# EAGLE design board_012518 (EAGLE 8.6.0)
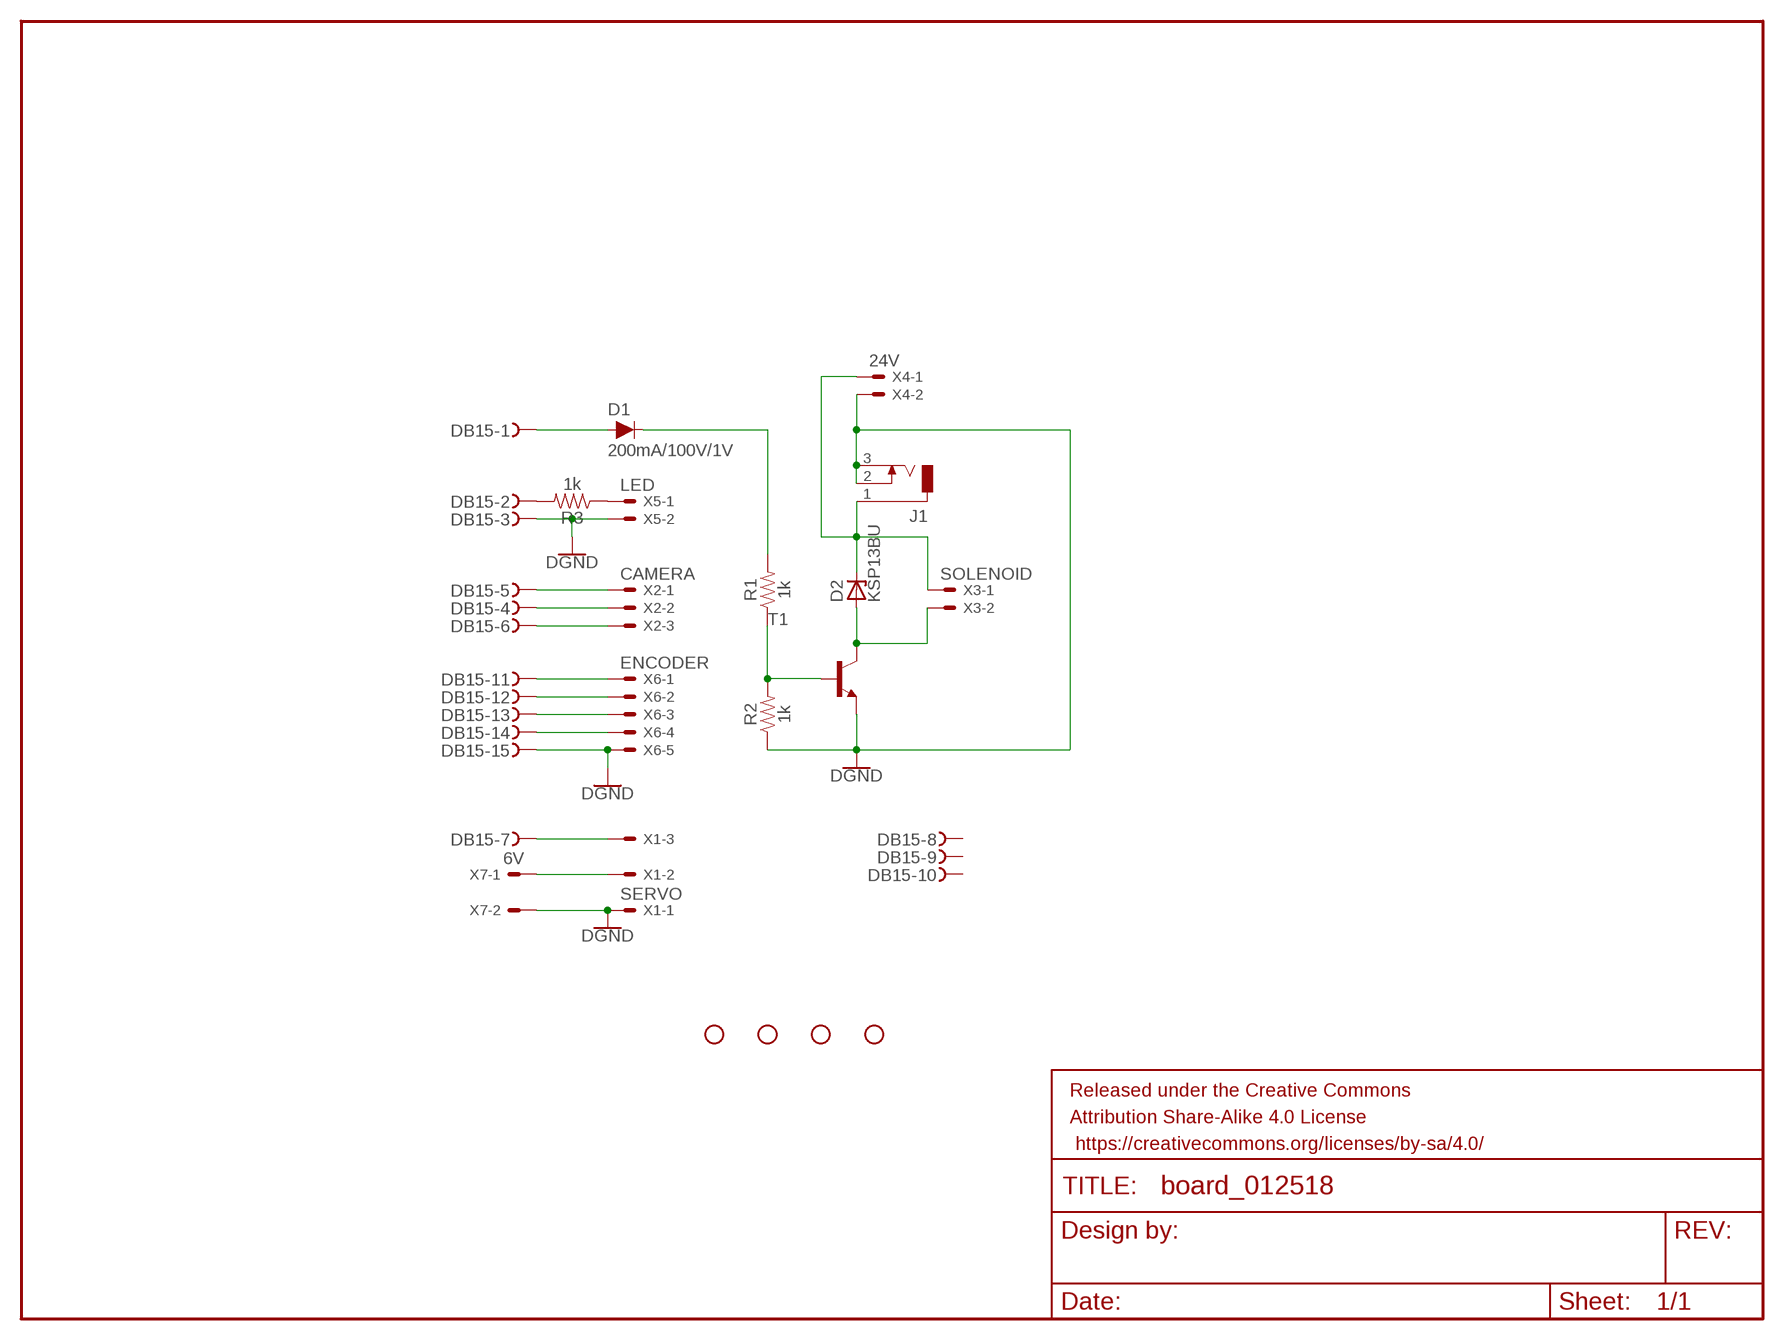
[diagram p0: schematic, sheet 1]

## Parts
D1  200mA/100V/1V  DIODE-1N4148  [DIODE-1N4148]
D2  KSP13BU  ZENER-DIODEP1-12  [P1Z12]
DB15  D-SUB15-HDR15RA  [HDR15RA]
FRAME1  FRAME-LETTER  [CREATIVE_COMMONS]
H1  STAND-OFF  [STAND-OFF]
H2  STAND-OFF  [STAND-OFF]
H3  STAND-OFF  [STAND-OFF]
H4  STAND-OFF  [STAND-OFF]
J1  DCJ0303  [DCJ0303]
R1  1k  1KOHM-HORIZ-1/4W-1%  [AXIAL-0.3]
R2  1k  1KOHM-HORIZ-1/4W-1%  [AXIAL-0.3]
R3  1k  1KOHM-HORIZ-1/4W-1%  [AXIAL-0.3]
T1  MPSA13-NPN-TO92-EBC  [TO92-EBC]
X1  SERVO  C-GRID-03-70553  [70553-03]
X2  CAMERA  C-GRID-03-70553  [70553-03]
X3  SOLENOID  C-GRID-02-70553  [70553-02]
X4  24V  C-GRID-02-70553  [70553-02]
X5  LED  C-GRID-02-70553  [70553-02]
X6  ENCODER  C-GRID-05-70553  [70553-05]
X7  6V  C-GRID-02-70553  [70553-02]

## Nets
GND: DB15.3 DB15.15 J1.2 J1.3 R2.P$1 T1.E X1.1 X4.2 X5.2 X6.5 X7.2 ; supply symbol labelled DGND
N$1: R1.P$1 R2.P$2 T1.B
N$2: D1.C R1.P$2
N$3: D1.A DB15.1
N$4: D2.A T1.C X3.2
N$5: D2.C J1.1 X3.1 X4.1
N$6: X1.2 X7.1
N$7: R3.P$1 X5.1
N$8: DB15.11 X6.1
N$9: DB15.12 X6.2
N$10: DB15.4 X2.2
N$11: DB15.13 X6.3
N$12: DB15.2 R3.P$2
N$13: DB15.14 X6.4
N$14: DB15.5 X2.1
N$16: DB15.6 X2.3
N$17: DB15.7 X1.3
Unconnected: DB15.8 DB15.9 DB15.10

## Library data of the parts
D1 = SparkFun-DiscreteSemi:DIODE: Diode These are standard reverse protection diodes and small signal diodes. SparkFun Products: SparkFun SparkPunk Sound Kit <https://www.sparkfun.com/products/11177> SparkFun ESP8266 Thing <https://www.sparkfun.com/products/13231>; PROD_ID: DIO-08378
D2 = diode:ZENER-DIODE: Z-Diode
DB15 = con-thomas-betts:D-SUB15-: D-Subminiatur Connector Source: Electronioc Interconnects European Edition 1998; OC_FARNELL: unknown; OC_NEWARK: unknown
FRAME1 = SparkFun-Aesthetics:FRAME-LETTER: Schematic Frame - Letter Standard 8.5x11 US Letter frame
H1-H4 = SparkFun-Hardware:STAND-OFF: Stand Off Drill holes for mechanically mounting via screws, standoffs, etc. Note: Use the keepout ring to avoid running the screw head into surrounding components. Variant Overviews STAND-OFF - Mechanical footprint for a #4 phillips button head screw. STAND-OFF-TIGHT - Mechanical footprint for a #4 phillips button head screw, Example SparkFun Products Screw - Phillips Head (1/4", 4-40, 10 pack) <https://www.sparkfun.com/products/10453> (PRT-10453) Screw - Phillips Head (1/2", 4-40, 10 pack) <https://www.sparkfun.com/products/10452> (PRT-10452) Screw - Phillips Head (3/4", 4-40, 10 pack) <https://www.sparkfun.com/products/10451> (PRT-10451) Screw - Phillips Head (1", 4-40, 10 pack) <https://www.sparkfun.com/products/10450> (PRT-10450)
J1 = con-jack:DCJ0303: DC POWER JACK Source: DCJ0303.pdf; OC_FARNELL: unknown; OC_NEWARK: unknown
R1-R3 = SparkFun-Resistors:1KOHM: 1kΩ resistor A resistor is a passive two-terminal electrical component that implements electrical resistance as a circuit element. Resistors act to reduce current flow, and, at the same time, act to lower voltage levels within circuits. - Wikipedia; PROD_ID: RES-12182
T1 = transistor:*-NPN-: NPN Transistror BF959 corrected 2008.03.06
X1 X2 = con-molex:C-GRID-03: CONNECTOR wire to board 2.54 mm (0.100") pitch header; MF: MOLEX; OC_FARNELL: unknown; OC_NEWARK: unknown
X3-X5 X7 = con-molex:C-GRID-02: CONNECTOR wire to board 2.54 mm (0.100") pitch header; MF: MOLEX; OC_FARNELL: unknown; OC_NEWARK: unknown
X6 = con-molex:C-GRID-05: CONNECTOR wire to board 2.54 mm (0.100") pitch header; MF: MOLEX; OC_FARNELL: unknown; OC_NEWARK: unknown

## Board
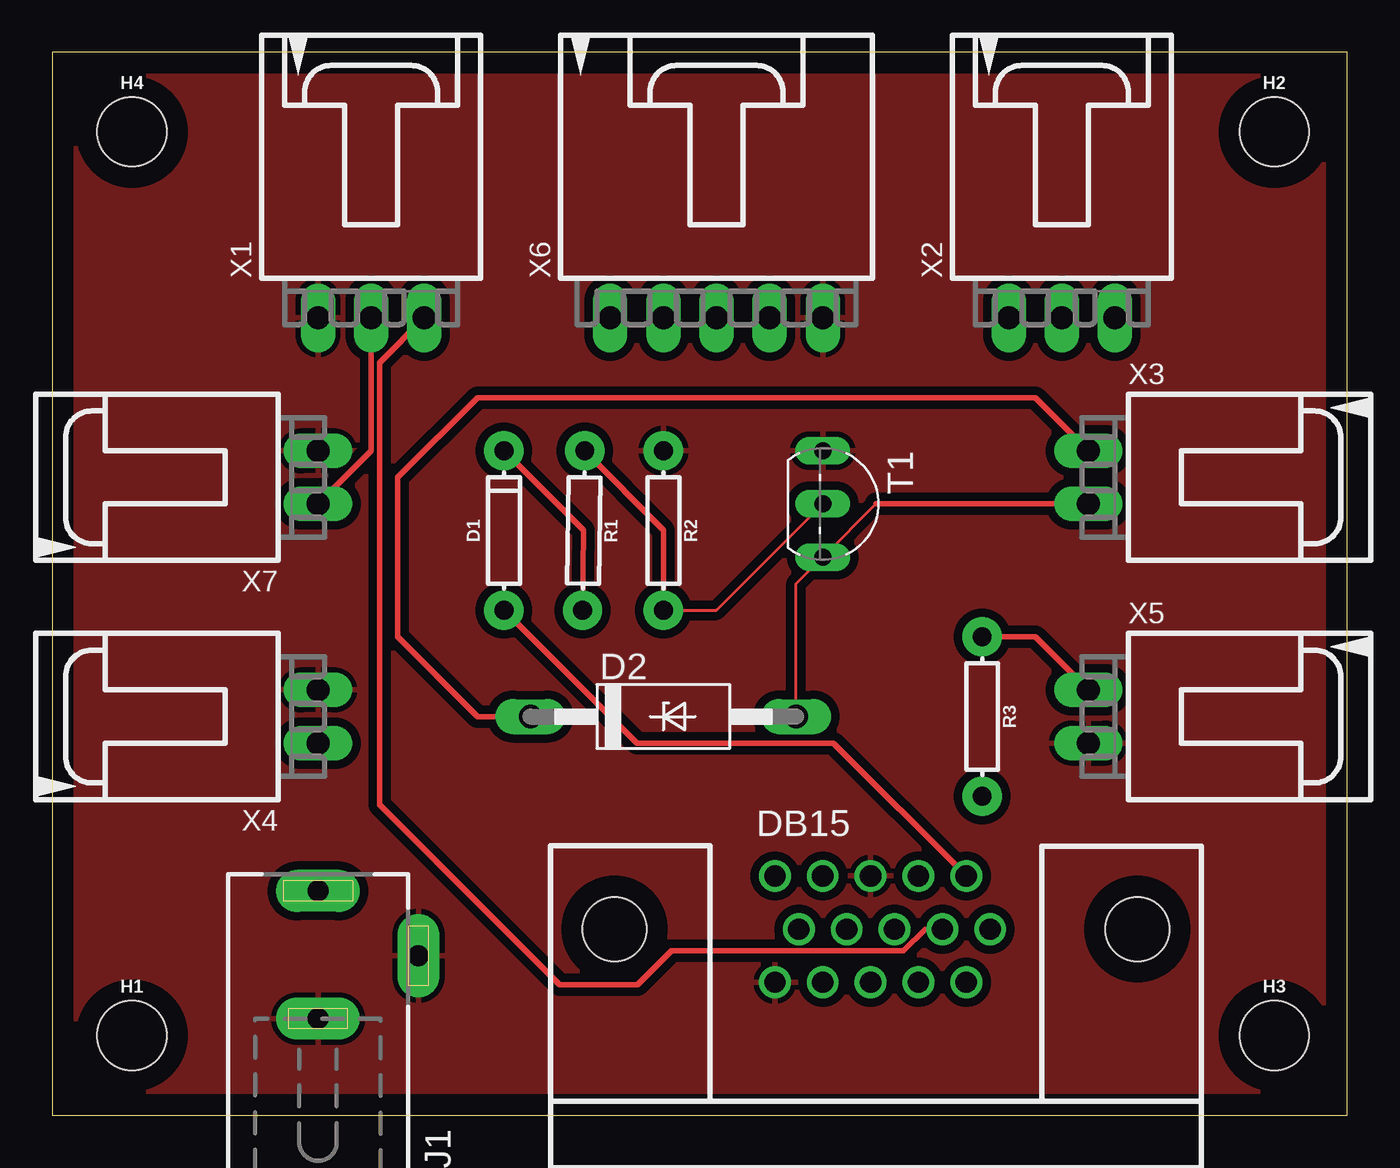
[diagram p1: board, top side]
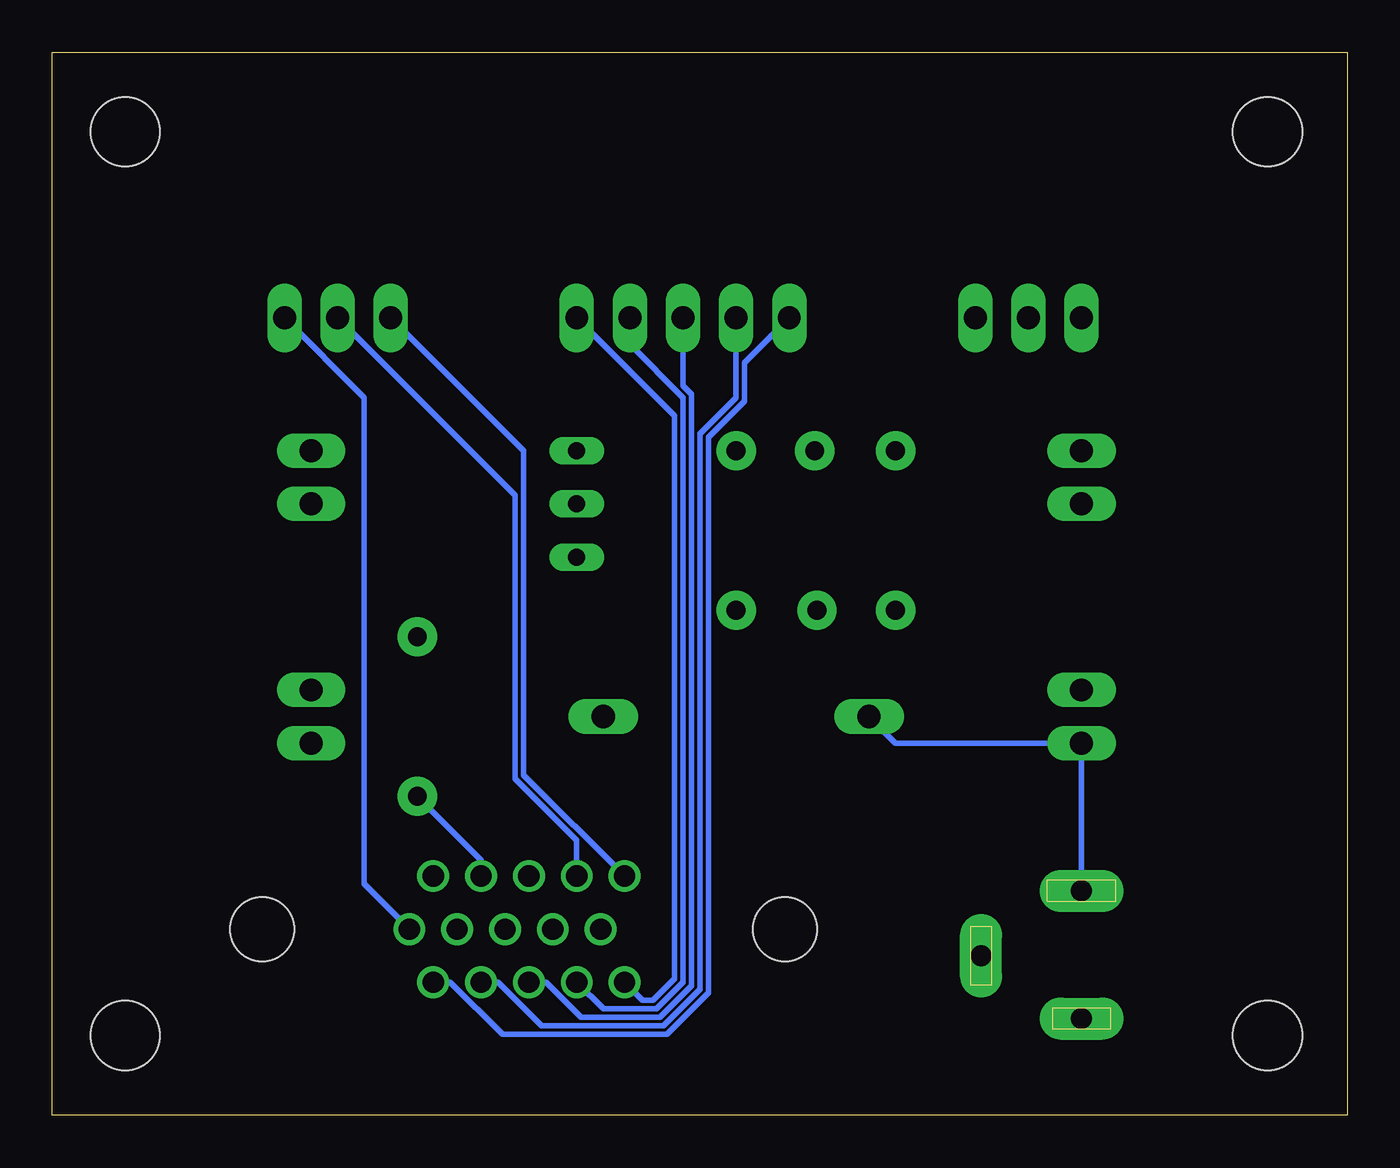
[diagram p2: board, bottom side, seen from below]

Size 61.9 x 50.79 mm. Coordinates in mm from the lower left corner, seen from the top.
Outline: 0,0 61.9,0 61.9,50.79 0,50.79 0,0
Copper layers (1*16): Top 0.035mm / dielectric 1.5mm / Bottom 0.035mm
Design rules "default": minimum track width 6mil, minimum drill 0.35mm, track to track 6mil, track to pad 6mil, pad to pad 6mil, via to via 6mil, smd to smd 6mil, copper to edge 40mil, drill to drill 6mil, minimum pad ring 10mil, minimum via ring 8mil, stop-mask expansion 4mil, vias tented up to drill 0mil, thermal gap 10mil

### Footprints (pad centres in the part's own frame; a part is rotated, then mirrored left to right if it is on the bottom)
DIODE-1N4148 = drill 0.9 pad 1.88: A -3.81,0; C 3.81,0
P1Z12 = drill 1.118 long: A 6.35,0; C -6.35,0
HDR15RA = drill 1.016: 1 4.318,2.54; 2 2.032,2.54; 3 -0.254,2.54; 4 -2.54,2.54; 5 -4.826,2.54; 6 5.461,0; 7 3.175,0; 8 0.889,0; 9 -1.397,0; 10 -3.683,0; 11 4.318,-2.54; 12 2.032,-2.54; 13 -0.254,-2.54; 14 -2.54,-2.54; 15 -4.826,-2.54 | hole 3.048: -12.497,0; 12.497,0
STAND-OFF = hole 3.302: 0,0
DCJ0303 = drill 1 pad 2 long: 1 0,3.1; 2 4.8,0; 3 0,-3
AXIAL-0.3 = drill 0.9 pad 1.88: P$1 -3.81,0; P$2 3.81,0
TO92-EBC = drill 0.813 long: B 0,-1.27; C 2.54,-1.27; E -2.54,-1.27
70553-03 = drill 1.092 long: 1 -2.54,-7.62; 2 0,-7.62; 3 2.54,-7.62
70553-02 = drill 1.092 long: 1 -1.27,-7.62; 2 1.27,-7.62
70553-05 = drill 1.092 long: 1 -5.08,-7.62; 2 -2.54,-7.62; 3 0,-7.62; 4 2.54,-7.62; 5 5.08,-7.62

### Placement (x,y rotation side)
D1  21.59,27.94 90 top
D2  29.21,19.05 0 top
DB15  39.37,8.89 0 top
FRAME1  12.7,-17.78 0 top  (outside the outline)
H1  3.81,3.81 0 top
H2  58.42,46.99 0 top
H3  58.42,3.81 0 top
H4  3.81,46.99 0 top
J1  12.7,7.62 0 top
R1  25.4,27.94 269.2 top
R2  29.21,27.94 270 top
R3  44.45,19.05 270 top
T1  38.1,29.21 270 top
X1  15.24,45.72 0 top
X2  48.26,45.72 0 top
X3  57.15,30.48 270 top
X4  5.08,19.05 90 top
X5  57.15,19.05 270 top
X6  31.75,45.72 0 top
X7  5.08,30.48 90 top

### Tracks (layer width: path | path; a pad name or v marks a point on that pad's centre or on a via)
GND
  Bottom 0.254: DB15.15 33.68,5.49 33.19,5.49 32.16,6.52 32.16,33.43 X6.5
  pour Top (isolate 0.406): 0,50.8 62.23,50.8 62.23,0 0,0
N$1
  Top 0.152: R2.P$2 31.75,24.13 T1.B
  Top 0.254: R1.P$1 29.21,27.94 R2.P$2
N$2
  Top 0.254: D1.C 25.4,27.94 R1.P$2
N$3
  Top 0.254: DB15.1 37.34,17.78 27.94,17.78 D1.A
N$4
  Top 0.152: D2.A 35.56,25.4 T1.C 39.37,29.21
  Top 0.254: X3.2 39.37,29.21
N$5
  Top 0.254: D2.C 20.32,19.05 16.51,22.86 16.51,30.48 20.32,34.29 46.99,34.29 X3.1
  Bottom 0.254: J1.1 X4.1 21.59,17.78 D2.C
N$6
  Top 0.254: X7.1 15.24,31.75 X1.2
N$7
  Top 0.254: R3.P$1 46.99,22.86 X5.1
N$8
  Bottom 0.254: DB15.11 42.88,6.35 40.39,3.86 32.52,3.86 30.53,5.84 30.53,31.75 30.53,32.03 30.53,32.39 28.8,34.12 28.8,35.97 X6.1
N$9
  Bottom 0.254: DB15.12 40.59,6.35 38.51,4.27 32.68,4.27 30.94,6.01 30.94,32.56 29.21,34.29 X6.2
N$10
  Bottom 0.254: DB15.4 36.83,13.14 39.78,16.09 39.78,29.62 X2.2
N$11
  Bottom 0.254: DB15.13 38.3,6.35 36.63,4.67 32.85,4.67 31.34,6.18 31.34,33.02 31.34,33.19 31.34,34.46 31.75,34.86 X6.3
N$12
  Bottom 0.254: R3.P$2 41.4,12.19 DB15.2
N$13
  Bottom 0.254: DB15.14 35.56,5.08 33.02,5.08 31.75,6.35 31.75,34.29 34.29,36.83 X6.4
N$14
  Bottom 0.254: DB15.5 39.37,16.26 39.37,31.75 X2.1
N$16
  Bottom 0.254: DB15.6 46.99,11.05 46.99,34.29 X2.3
N$17
  Top 0.254: DB15.7 41.73,8.89 40.69,7.85 29.6,7.85 27.98,6.22 24.26,6.22 15.65,14.83 15.65,35.97 X1.3